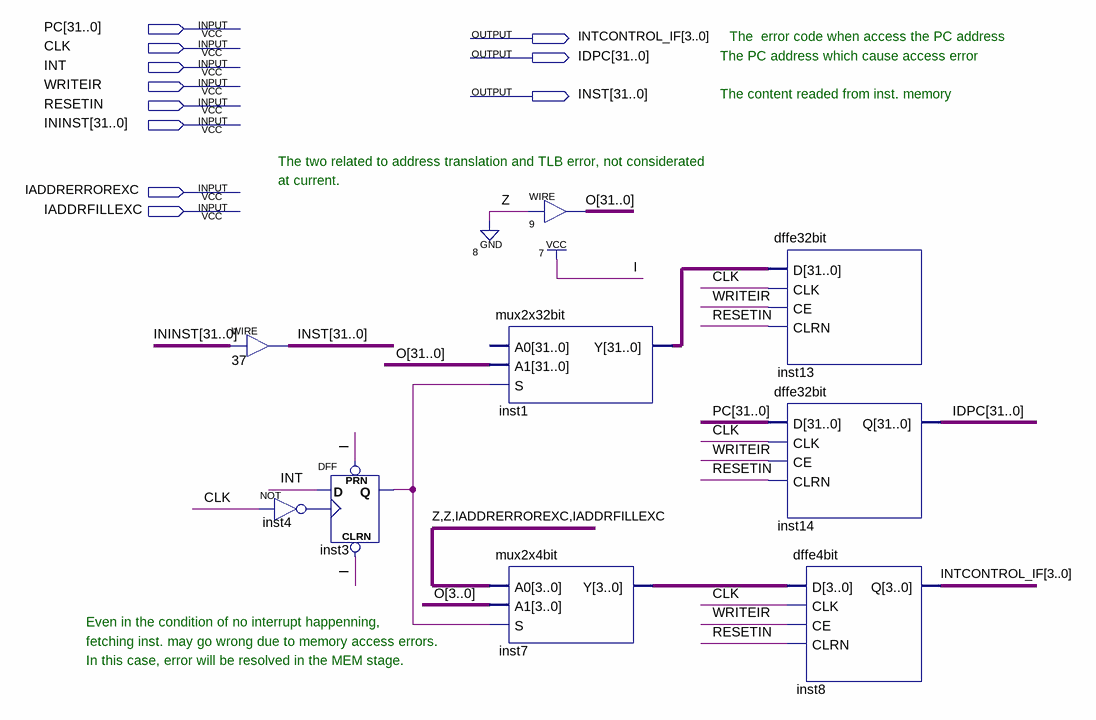
[diagram p0: schematic sheet]
// Quartus schematic INST-FETCHER.bdf as structural Verilog: 9 symbols, 11 pins
module \INST-FETCHER  (
  input  [31:0] PC,
  input  CLK,
  input  INT,
  input  WRITEIR,
  input  RESETIN,
  input  [31:0] ININST,
  input  IADDRERROREXC,
  input  IADDRFILLEXC,
  output [3:0] INTCONTROL_IF,
  output [31:0] IDPC,
  output [31:0] INST
);

  wire inst3_q, inst4_out;
  wire [3:0] inst7_y;
  wire [31:0] inst1_y, O;

  assign INST = ININST;  // WIRE 37
  not inst4 (inst4_out, CLK);
  DFF inst3 (.CLRN(1'b1), .CLK(inst4_out), .D(INT), .PRN(1'b1), .Q(inst3_q));
  mux2x32bit inst1 (.A1(O), .S(inst3_q), .Y(inst1_y));  // open: A0
  mux2x4bit inst7 (.A0({2'b00, IADDRERROREXC, IADDRFILLEXC}), .A1(O[3:0]), .S(inst3_q), .Y(inst7_y));
  assign O = {32{1'b0}};  // WIRE 9
  dffe32bit inst13 (.D(inst1_y), .CLK(CLK), .CE(WRITEIR), .CLRN(RESETIN));
  dffe32bit inst14 (.D(PC), .CLK(CLK), .CE(WRITEIR), .CLRN(RESETIN), .Q(IDPC));
  dffe4bit inst8 (.D(inst7_y), .CLK(CLK), .CE(WRITEIR), .CLRN(RESETIN), .Q(INTCONTROL_IF));

  // Notes on the sheet:
  //   The  error code when access the PC address
  //   The PC address which cause access error
  //   The content readed from inst. memory
  //   The two related to address translation and TLB error, not considerated
  //   at current.
  //   Even in the condition of no interrupt happenning,
  //   fetching inst. may go wrong due to memory access errors.
  //   In this case, error will be resolved in the MEM stage.
endmodule
